# Altium schematic sheet CAN.SchDoc
size A4; Revision: B.2(PCB.SCH)
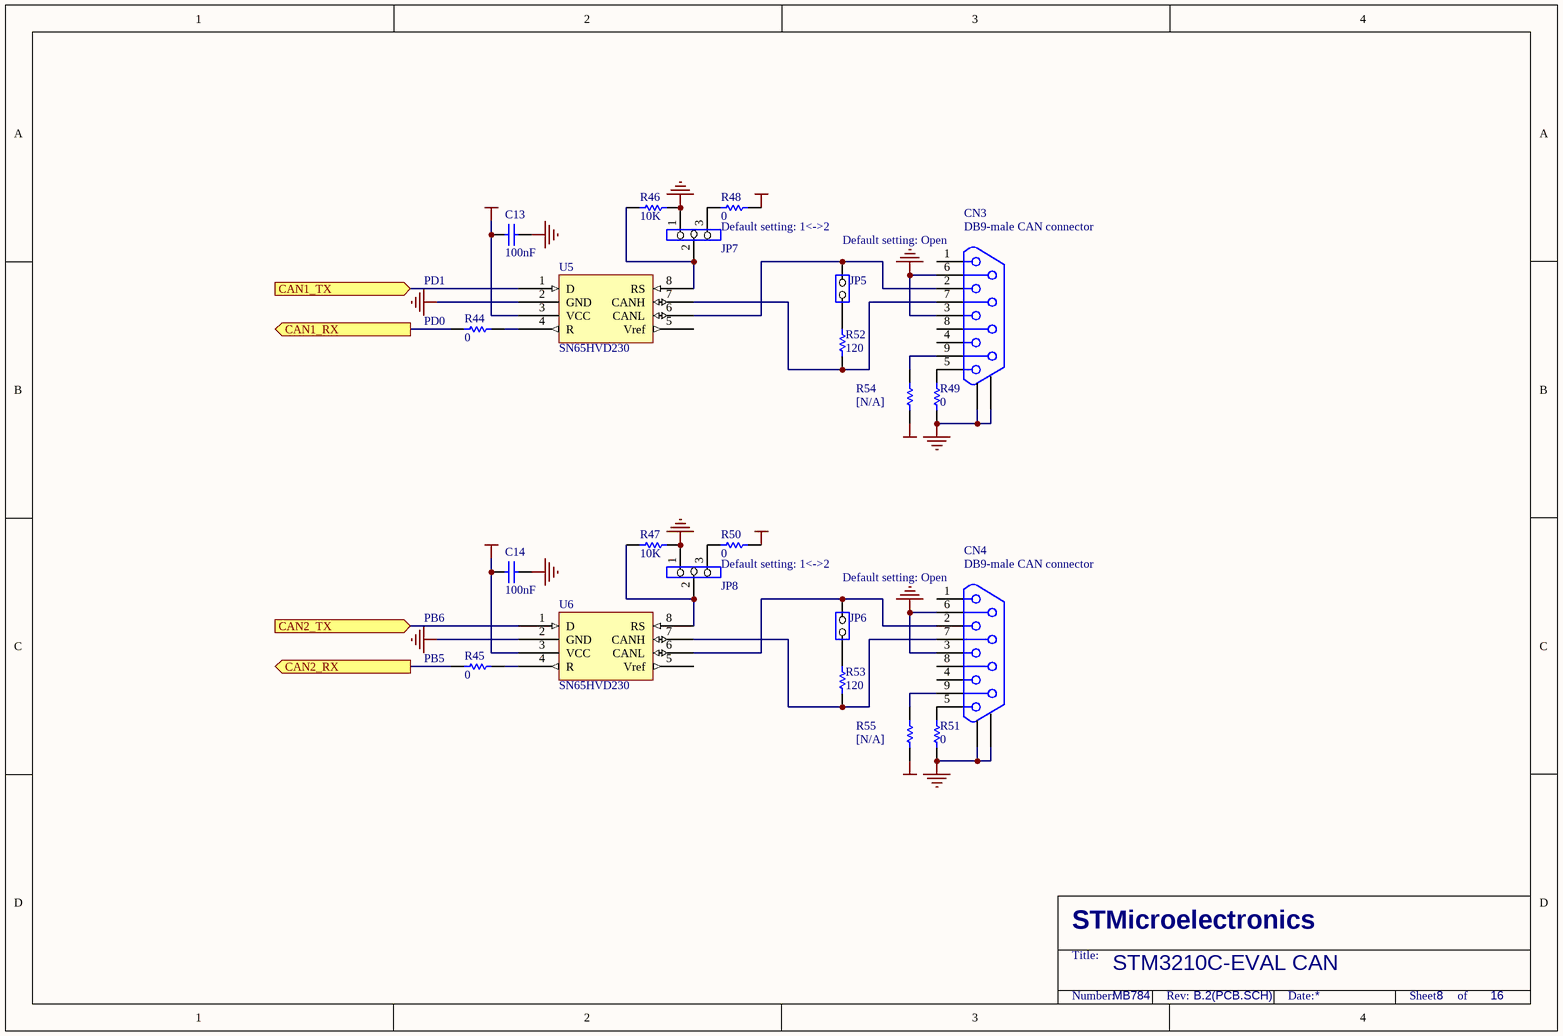
[diagram p0: CAN.SchDoc]

## Parts
C13  100nF  [0603C]
C14  100nF  [0603C]
CN3  DB9-male CAN connector  [DB9/M]
CN4  DB9-male CAN connector  [DB9/M]
JP5  (no value)  [SIP2]
JP6  (no value)  [SIP2]
JP7  (no value)  [SIP3]
JP8  (no value)  [SIP3]
R44  0  [0603R]
R45  0  [0603R]
R46  10K  [0603R]
R47  10K  [0603R]
R48  0  [0603R]
R49  0  [0603R]
R50  0  [0603R]
R51  0  [0603R]
R52  120  [0603R]
R53  120  [0603R]
R54  [N/A]  [0603R]
R55  [N/A]  [0603R]
U5  SN65HVD230  [SO8]
U6  SN65HVD230  [SO8]

## Ports
CAN1_RX (out), CAN1_TX (in), CAN2_RX (out), CAN2_TX (in)

## Nets
+3V3: C13.2 C14.2 R48.2 R50.2 R54.1 R55.1 U5.3(VCC) U6.3(VCC)
GND: C13.1 C14.1 CN3.0 CN3.3 CN3.6 CN4.0 CN4.3 CN4.6 JP7.1 JP8.1 R46.2 R47.2 R49.1 R51.1 U5.2(GND) U6.2(GND)
CAN1_RX: R44.2 ; port CAN1_RX
CAN1_TX: U5.1(D) ; port CAN1_TX
CAN2_RX: R45.2 ; port CAN2_RX
CAN2_TX: U6.1(D) ; port CAN2_TX
NetCN3_2: CN3.2 JP5.2(NO) U5.6(CANL)
NetCN3_5: CN3.5 R49.2
NetCN3_7: CN3.7 R52.1 U5.7(CANH)
NetCN3_9: CN3.9 R54.2
NetCN4_2: CN4.2 JP6.2(NO) U6.6(CANL)
NetCN4_5: CN4.5 R51.2
NetCN4_7: CN4.7 R53.1 U6.7(CANH)
NetCN4_9: CN4.9 R55.2
NetJP5_1: JP5.1(COMMON) R52.2
NetJP6_1: JP6.1(COMMON) R53.2
NetJP7_2: JP7.2 R46.1 U5.8(RS)
NetJP7_3: JP7.3 R48.1
NetJP8_2: JP8.2 R47.1 U6.8(RS)
NetJP8_3: JP8.3 R50.1
NetR44_1: R44.1 U5.4(R)
NetR45_1: R45.1 U6.4(R)

Not connected (* = marked no-connect by the designer): CN3 1 4 8; CN4 1 4 8; U5 5(Vref); U6 5(Vref)

## Notes on the sheet
- Default setting: 1<->2
- (near CN3) Default setting: Open
- (near R44) PD1
- (near R44) PD0
- (near CN4) Default setting: Open
- (near R45) PB6
- (near R45) PB5
- STM3210C-EVAL CAN
- MB784
- 8
- 16
- STMicroelectronics
- Title:
- Number:
- Rev:
- Date:
- Sheet       of

## Library data of the parts
C13 C14 = CAP: Capacitor; Published: 8-Jun-2000; Revision: July-2002: Re-released for DXP Platform.; Publisher: Altium Limited; Value: 100nF
CN3 CN4 = DB9
JP5 JP6 = JP2
JP7 JP8 = Jumper3
R44 R45 = Res1: Resistor; Value: 1K; Published: 8-Jun-2000; Revision: July-2002: Re-released for DXP Platform.; Publisher: Altium Limited
R46-R55 = res1: Resistor; Value: 1K; Published: 8-Jun-2000; Revision: July-2002: Re-released for DXP Platform.; Publisher: Altium Limited
U5 U6 = SN65HVD230D